# Altium schematic sheet 02_MCU.SchDoc
size A4; Author: Sasa Karanovic; Organization: Altium Limited; DocumentNumber: 1; SheetNumber: 2; SheetTotal: 4; sk_ProjectName: DIY E-Ink Gadget; sk_title: Microcontroller
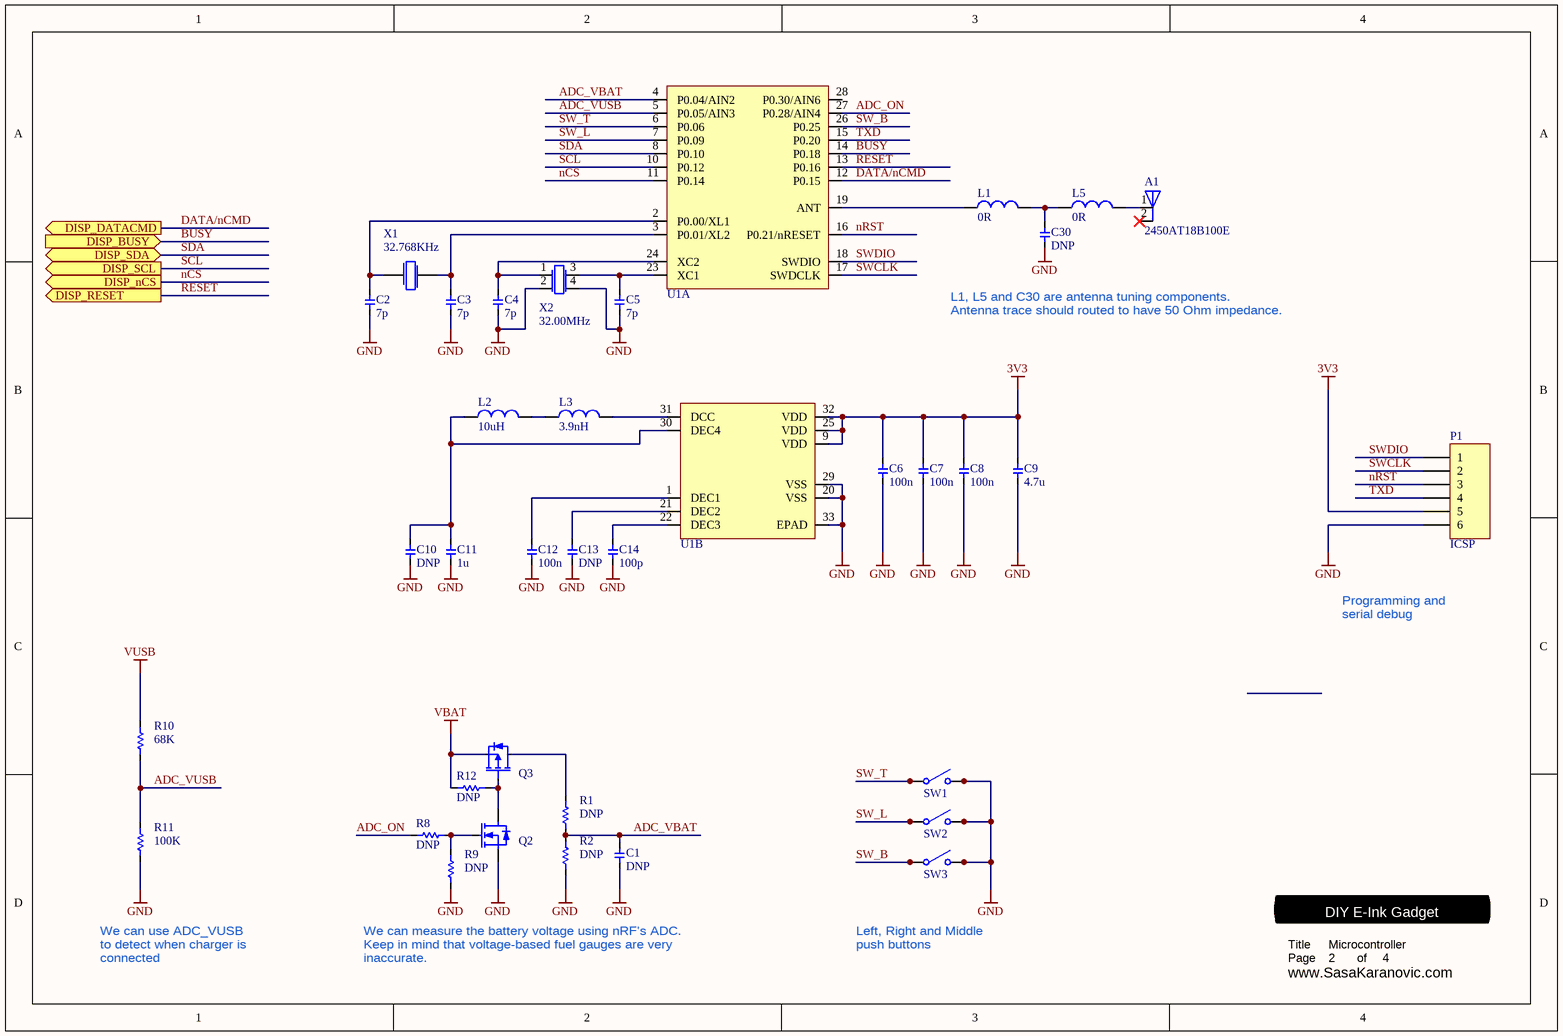
[diagram p0: 02_MCU.SchDoc]

## Parts
A1  2450AT18B100E  [2450AT18B100]
C1  value DNP  [0603 - CAP]  (hidden comment: Cap)  (no BOM)
C2  value 7p  [0603 - CAP]  (hidden comment: Cap)
C3  value 7p  [0603 - CAP]  (hidden comment: Cap)
C4  value 7p  [0603 - CAP]  (hidden comment: Cap)
C5  value 7p  [0603 - CAP]  (hidden comment: Cap)
C6  value 100n  [0603 - CAP]  (hidden comment: Cap)
C7  value 100n  [0603 - CAP]  (hidden comment: Cap)
C8  value 100n  [0603 - CAP]  (hidden comment: Cap)
C9  value 4.7u  [0603 - CAP]  (hidden comment: Cap)
C10  value DNP  [0603 - CAP]  (hidden comment: Cap)  (no BOM)
C11  value 1u  [0603 - CAP]  (hidden comment: Cap)
C12  value 100n  [0603 - CAP]  (hidden comment: Cap)
C13  value DNP  [0603 - CAP]  (hidden comment: Cap)  (no BOM)
C14  value 100p  [0603 - CAP]  (hidden comment: Cap)
C30  value DNP  [0603 - CAP]  (hidden comment: Cap)  (no BOM)
L1  value 0R  [0603_IND]  (hidden comment: Inductor)
L2  value 10uH  [0603_IND]  (hidden comment: Inductor)
L3  value 3.9nH  [0603_IND]  (hidden comment: Inductor)
L5  value 0R  [0603_IND]  (hidden comment: Inductor)
P1  ICSP  [Header 6x1 M - 90Deg - SMT]  (no BOM)
Q2  DMN62D0U-13  [SOT90P240X100-3N]  (value not drawn)  (no BOM)
Q3  DMP3017SFG  [SOT-23]  (value not drawn)  (no BOM)
R1  value DNP  [0603]  (hidden comment: Res)  (no BOM)
R2  value DNP  [0603]  (hidden comment: Res)  (no BOM)
R8  value DNP  [0603]  (hidden comment: Res)  (no BOM)
R9  value DNP  [0603]  (hidden comment: Res)  (no BOM)
R10  value 68K  [0603]  (hidden comment: Res)
R11  value 100K  [0603]  (hidden comment: Res)
R12  value DNP  [0603]  (hidden comment: Res)  (no BOM)
SW1  SWITCH TACTILE SPST-NO 0.05A 12V  [PTS645]  (value not drawn)
SW2  SWITCH TACTILE SPST-NO 0.05A 12V  [PTS645]  (value not drawn)
SW3  SWITCH TACTILE SPST-NO 0.05A 12V  [PTS645]  (value not drawn)
U1  NRF52810-QCAA-R  [QFN50P500X500X100_HS-33N]  (value not drawn)  (parts A,B of 2)
X1  32.768KHz  [XTAL-2LEAD-3215]
X2  32.00MHz  [XTAL-4LEAD-2016]

## Ports
DISP_BUSY (in), DISP_DATACMD (out), DISP_nCS (out), DISP_RESET (out), DISP_SCL (out), DISP_SDA (bidir)

## Nets
3V3: C6.2 C7.2 C8.2 C9.2 P1.5 U1.9(VDD) U1.25(VDD) U1.32(VDD)
GND: C1.1 C2.1 C3.1 C4.1 C5.1 C6.1 C7.1 C8.1 C9.1 C10.1 C11.1 C12.1 C13.1 C14.1 C30.1 P1.6 Q2.2(S) R2.1 R9.1 R11.1 SW1.3(COMMON2) SW1.4(COMMON2) SW2.3(COMMON2) SW2.4(COMMON2) SW3.3(COMMON2) SW3.4(COMMON2) U1.20(VSS) U1.29(VSS) U1.33(EPAD) X2.2(GND) X2.4(GND)
VBAT: Q3.3(S) R12.2
VUSB: R10.2
ADC_ON: R8.2 U1.27(P0.28/AIN4)
ADC_VBAT: C1.2 R1.1 R2.2 U1.4(P0.04/AIN2)
ADC_VUSB: R10.1 R11.2 U1.5(P0.05/AIN3)
BUSY: U1.14(P0.18) ; port DISP_BUSY
DATA/nCMD: U1.12(P0.15) ; port DISP_DATACMD
nCS: U1.11(P0.14) ; port DISP_nCS
nRST: P1.3 U1.16(P0.21/nRESET)
RESET: U1.13(P0.16) ; port DISP_RESET
SCL: U1.10(P0.12) ; port DISP_SCL
SDA: U1.8(P0.10) ; port DISP_SDA
SW_B: SW3.1(COMMON1) SW3.2(COMMON1) U1.26(P0.25)
SW_L: SW2.1(COMMON1) SW2.2(COMMON1) U1.7(P0.09)
SW_T: SW1.1(COMMON1) SW1.2(COMMON1) U1.6(P0.06)
SWCLK: P1.2 U1.17(SWDCLK)
SWDIO: P1.1 U1.18(SWDIO)
TXD: P1.4 U1.15(P0.20)
NetA1_1: A1.1(FEED) L5.2
NetC2_2: C2.2 U1.2(P0.00/XL1) X1.1
NetC3_2: C3.2 U1.3(P0.01/XL2) X1.2
NetC4_2: C4.2 U1.24(XC2) X2.1(OSC1)
NetC5_2: C5.2 U1.23(XC1) X2.3(OSC3)
NetC10_2: C10.2 C11.2 L2.1 U1.30(DEC4)
NetC12_2: C12.2 U1.1(DEC1)
NetC13_2: C13.2 U1.21(DEC2)
NetC14_2: C14.2 U1.22(DEC3)
NetC30_2: C30.2 L1.2 L5.1
NetL1_1: L1.1 U1.19(ANT)
NetL2_2: L2.2 L3.1
NetL3_2: L3.2 U1.31(DCC)
NetQ2_1: Q2.1(G) R8.1 R9.2
NetQ2_3: Q2.3(D) Q3.1(G) R12.1
NetQ3_2: Q3.2(D) R1.2

Not connected (* = marked no-connect by the designer): A1 2(NC)*; U1 28(_P0.30/AIN6)

## Notes on the sheet
- L1, L5 and C30 are antenna tuning components.
  Antenna trace should routed to have 50 Ohm impedance.
- Programming and serial debug
- We can use ADC_VUSB to detect when charger is connected
- We can measure the battery voltage using nRF's ADC.
  Keep in mind that voltage-based fuel gauges are very inaccurate.
- Left, Right and Middle push buttons
- Page
- Title
- www.SasaKaranovic.com <http://www.SasaKaranovic.com>
- of

## Library data of the parts
A1 = 2450AT18B100E: 2.4GHz - Chip RF Antenna 2.4GHz ~ 2.5GHz 0.5dBi Solder Surface Mount; Manufacturer: Johanson Technology Inc.; Manufacturer Part Number: 2450AT18B100E; Distributor: DigiKey; Distributor Part Number: 712-1006-1-ND
C1 C10 C13 C30 = Cap: Capacitor
C2-C5 = Cap: Capacitor; Manufacturer: Samsung Electro-Mechanics; Manufacturer Part Number: CL10C070DB8NNNC; Distributor Part Number: 1276-2138-1-ND; Distributor: DigiKey
C6-C8 C12 = Cap: Capacitor; Manufacturer: Samsung Electro-Mechanics; Manufacturer Part Number: CL10B104KB8NNWC; Distributor Part Number: 1276-1935-1-ND; Distributor: DigiKey
C9 = Cap: Capacitor; Manufacturer: Samsung Electro-Mechanics; Manufacturer Part Number: CL10B475KQ8NQNC; Distributor Part Number: 1276-2087-1-ND; Distributor: DigiKey
C11 = Cap: Capacitor; Manufacturer: Samsung Electro-Mechanics; Manufacturer Part Number: CL10B105KA8VPNC; Distributor Part Number: 1276-6617-1-ND; Distributor: DigiKey
C14 = Cap: Capacitor; Manufacturer: Samsung Electro-Mechanics; Manufacturer Part Number: CL10C101JB8NNNC; Distributor Part Number: 1276-1008-1-ND; Distributor: DigiKey
L1 L5 = Inductor: Manufacturer: YAGEO; Manufacturer Part Number: RC0603FR-070RL; Distributor: DigiKey; Distributor Part Number: 311-0.0HRCT-ND
L2 = Inductor: Manufacturer: Abracon LLC; Manufacturer Part Number: ASMCI-0603-100M-T; Distributor: DigiKey; Distributor Part Number: 535-12249-1-ND
L3 = Inductor: Manufacturer: Abracon LLC; Manufacturer Part Number: AIMC-0603-3N9S-T; Distributor: DigiKey; Distributor Part Number: 535-11540-1-ND
P1 = Header 6: Header, 6-Pin
Q2 = DMN62D0U-13: MOSFET N-CH 60V 0.38A; Manufacturer: Diodes Incorporated; Manufacturer Part Number: DMN62D0U-13; Distributor: DigiKey; Distributor Part Number: DMN62D0U-13DICT-ND
Q3 = DMP3017SFG: P-Channel MOSFET; PackageReference: E3; PackageDescription: TO, Flat Index; 3 In-Line, Axial Leads; Body Dia. 4.6mm; Lead Dia. 0.5 mm (max)
R1 R2 R8 R9 R12 = Res: Resistor
R10 = Res: Resistor; Manufacturer: YAGEO; Manufacturer Part Number: RC0603FR-0768KL; Distributor: DigiKey; Distributor Part Number: 311-68.0KHRCT-ND
R11 = Res: Resistor; Manufacturer: YAGEO; Manufacturer Part Number: RC0603FR-07100KL; Distributor: DigiKey; Distributor Part Number: 311-100KHRCT-ND
SW1-SW3 = PTS645SL50SMTR92 LFS: Manufacturer: C&K; Distributor Part Number: CKN9088CT-ND; Manufacturer Part Number: PTS645SL50SMTR92 LFS; Distributor: DigiKey
U1 = NRF52810-QCAA-R: IC RF TxRx + MCU Bluetooth Bluetooth v5.0 2.4GHz 32-VFQFN Exposed Pad; Manufacturer: Nordic Semiconductor ASA; Manufacturer Part Number: NRF52810-QCAA-R; Distributor: DigiKey; Distributor Part Number: 1490-NRF52810-QCAA-RCT-ND
X1 = XTAL-32.768KHz-SC32S-7PF20PPM: 32.768 kHz ±20ppm Crystal 7pF 70 kOhms 2-SMD, No Lead; Manufacturer: ECS Inc.; Manufacturer Part Number: ECS-320-8-37B-CKY-TR; Distributor: DigiKey; Distributor Part Number: XC3067CT-ND
X2 = XTAL-32MHz-ECS-320-8-37B-CKY-TR: 32 MHz ±10ppm Crystal 8pF 50 Ohms 4-SMD, No Lead; Manufacturer: ECS Inc.; Manufacturer Part Number: ECS-320-8-37B-CKY-TR; Distributor: DigiKey; Distributor Part Number: XC3067CT-ND